# Altium schematic sheet nRF.SchDoc
size A3; SheetNumber: 2; SheetTotal: 4
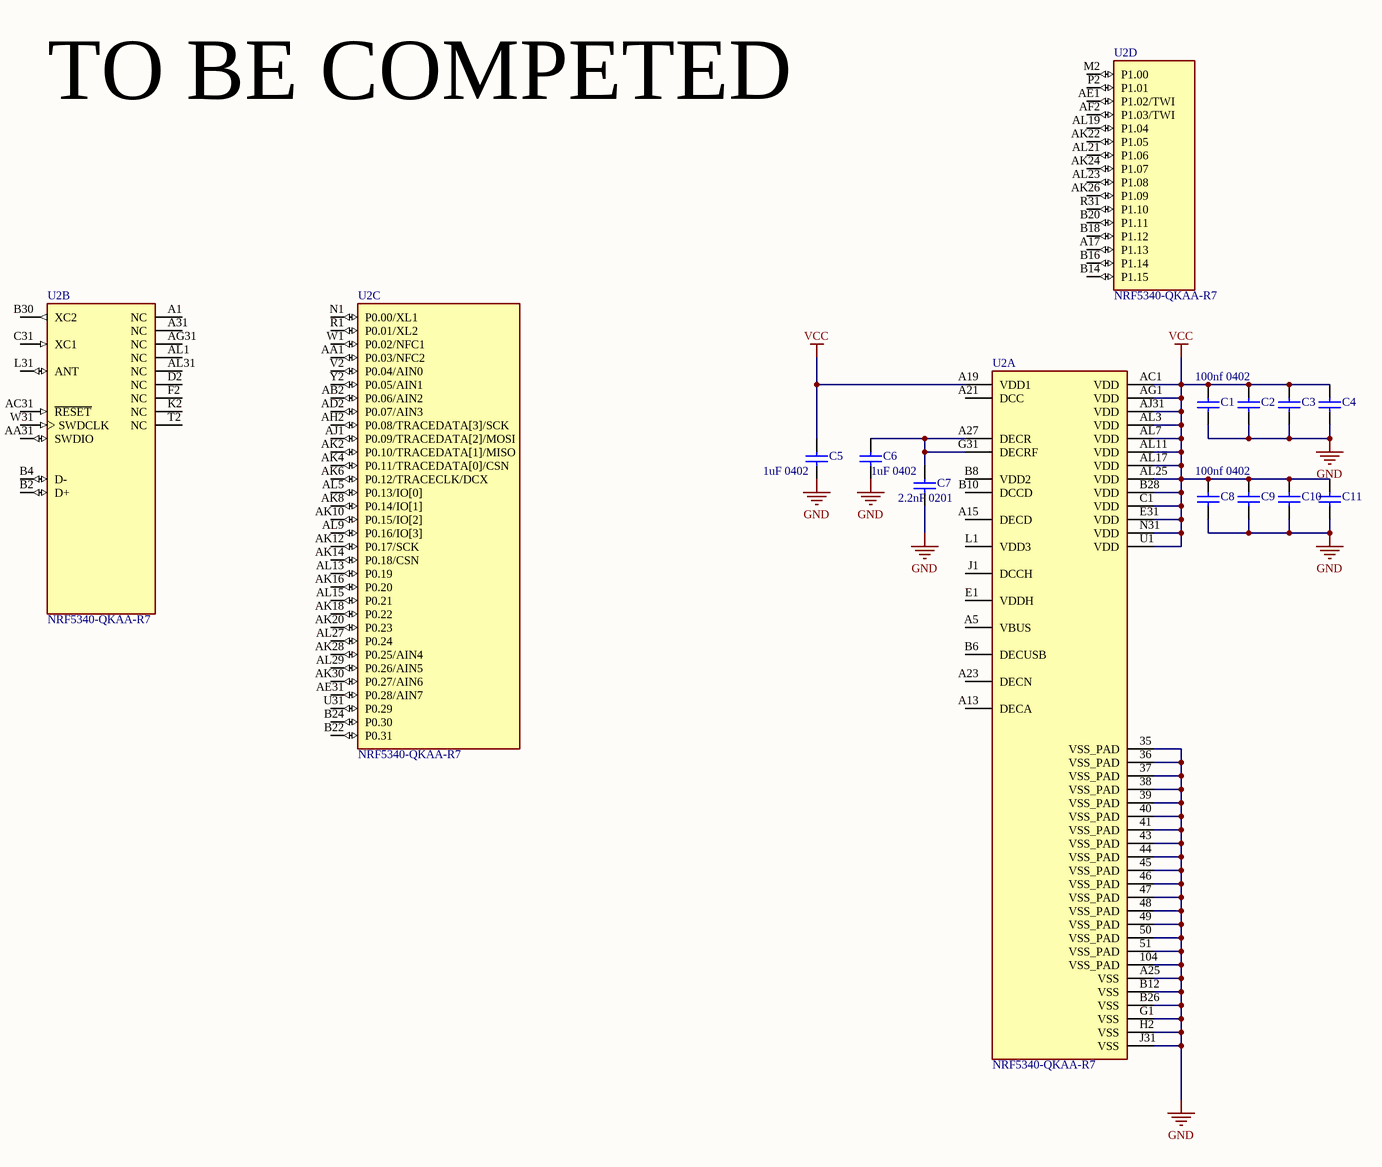
[diagram p0: nRF.SchDoc]

## Parts
C1  100nf 0402
C2  100nf 0402  (value not drawn)
C3  100nf 0402  (value not drawn)
C4  100nf 0402  (value not drawn)
C5  1uF 0402
C6  1uF 0402
C7  2.2nF 0201
C8  100nf 0402
C9  100nf 0402  (value not drawn)
C10  100nf 0402  (value not drawn)
C11  100nf 0402  (value not drawn)
U2  NRF5340-QKAA-R7  [XCVR_NRF5340-QKAA-R7]  (parts A,B,C,D of 4)

## Nets
GND: C1.1 C2.1 C3.1 C4.1 C5.1 C6.1 C7.1 C8.1 C9.1 C10.1 C11.1 U2.35(VSS_PAD) U2.36(VSS_PAD) U2.37(VSS_PAD) U2.38(VSS_PAD) U2.39(VSS_PAD) U2.40(VSS_PAD) U2.41(VSS_PAD) U2.43(VSS_PAD) U2.44(VSS_PAD) U2.45(VSS_PAD) U2.46(VSS_PAD) U2.47(VSS_PAD) U2.48(VSS_PAD) U2.49(VSS_PAD) U2.50(VSS_PAD) U2.51(VSS_PAD) U2.104(VSS_PAD) U2.A25(VSS) U2.B12(VSS) U2.B26(VSS) U2.G1(VSS) U2.H2(VSS) U2.J31(VSS)
VCC: C1.2 C2.2 C3.2 C4.2 C5.2 C8.2 C9.2 C10.2 C11.2 U2.A19(VDD1) U2.AC1(VDD) U2.AG1(VDD) U2.AJ31(VDD) U2.AL3(VDD) U2.AL7(VDD) U2.AL11(VDD) U2.AL17(VDD) U2.AL25(VDD) U2.B28(VDD) U2.C1(VDD) U2.E31(VDD) U2.N31(VDD) U2.U1(VDD)
NetC6_2: C6.2 C7.2 U2.A27(DECR) U2.G31(DECRF)

Not connected (* = marked no-connect by the designer): U2 A1(NC) A5(VBUS) A13(DECA) A15(DECD) A17(P1.13) A21(DCC) A23(DECN) A31(NC) AA1(P0.03/NFC2) AA31(SWDIO) AB2(P0.06/AIN2) AC31(~{RESET}) AD2(P0.07/AIN3) AE1(P1.02/TWI) AE31(P0.28/AIN7) AF2(P1.03/TWI) AG31(NC) AH2(P0.08/TRACEDATA[3]/SCK) AJ1(P0.09/TRACEDATA[2]/MOSI) AK2(P0.10/TRACEDATA[1]/MISO) AK4(P0.11/TRACEDATA[0]/CSN) AK6(P0.12/TRACECLK/DCX) AK8(P0.14/IO[1]) AK10(P0.15/IO[2]) AK12(P0.17/SCK) AK14(P0.18/CSN) AK16(P0.20) AK18(P0.22) AK20(P0.23) AK22(P1.05) AK24(P1.07) AK26(P1.09) AK28(P0.25/AIN4) AK30(P0.27/AIN6) AL1(NC) AL5(P0.13/IO[0]) AL9(P0.16/IO[3]) AL13(P0.19) AL15(P0.21) AL19(P1.04) AL21(P1.06) AL23(P1.08) AL27(P0.24) AL29(P0.26/AIN5) AL31(NC) B2(D+) B4(D-) B6(DECUSB) B8(VDD2) B10(DCCD) B14(P1.15) B16(P1.14) B18(P1.12) B20(P1.11) B22(P0.31) B24(P0.30) B30(XC2) C31(XC1) D2(NC) E1(VDDH) F2(NC) J1(DCCH) K2(NC) L1(VDD3) L31(ANT) M2(P1.00) N1(P0.00/XL1) P2(P1.01) R1(P0.01/XL2) R31(P1.10) T2(NC) U31(P0.29) V2(P0.04/AIN0) W1(P0.02/NFC1) W31(SWDCLK) Y2(P0.05/AIN1)

## Notes on the sheet
- TO BE COMPETED

## Library data of the parts
C1-C4 C8-C11 = 100nf 0402: Capacitor; Published: 8-Jun-2000; LatestRevisionDate: 17-Jul-2002; LatestRevisionNote: Re-released for DXP Platform.; PackageReference: RAD-0.3; Publisher: Altium Limited; PackageDescription: Radial Cap, Thru-Hole; 2 Leads; 0.3 in Pin Spacing
C5 C6 = 1uF 0402: Capacitor; Published: 8-Jun-2000; LatestRevisionDate: 17-Jul-2002; LatestRevisionNote: Re-released for DXP Platform.; PackageReference: RAD-0.3; Publisher: Altium Limited; PackageDescription: Radial Cap, Thru-Hole; 2 Leads; 0.3 in Pin Spacing
C7 = 2.2nF 0201: Capacitor; Published: 8-Jun-2000; LatestRevisionDate: 17-Jul-2002; LatestRevisionNote: Re-released for DXP Platform.; PackageReference: RAD-0.3; Publisher: Altium Limited; PackageDescription: Radial Cap, Thru-Hole; 2 Leads; 0.3 in Pin Spacing
U2 = NRF5340-QKAA-R7: RF System on a Chip - SoC Dual-core Bluetooth 5.2 SoC supporting Bluetooth Low Energy, Bluetooth mesh, NFC, Thread, and Zigbee; MF: Nordic Semiconductor ASA; Purchase-URL: https://pricing.snapeda.com/search/part/NRF5340-QKAA-R7/?ref=eda; Package: None; Check_prices: https://www.snapeda.com/parts/NRF5340-QKAA-R7/Nordic+Semiconductor+ASA/view-part/?ref=eda; Price: None; SnapEDA_Link: https://www.snapeda.com/parts/NRF5340-QKAA-R7/Nordic+Semiconductor+ASA/view-part/?ref=snap; Availability: In Stock; MP: NRF5340-QKAA-R7; Value: *